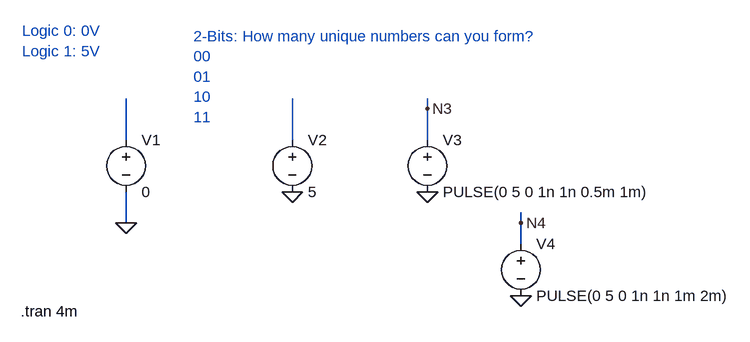
[diagram p0: schematic Sources.asc]
Sources.asc, the LTspice schematic file:
Version 4.1.1
SHEET 1 1336 680
WIRE 576 -32 576 -48
WIRE 112 16 112 -48
WIRE 368 16 368 -48
WIRE 576 16 576 -32
WIRE 112 144 112 96
WIRE 720 144 720 128
WIRE 720 176 720 144
FLAG 112 144 0
FLAG 368 96 0
FLAG 576 96 0
FLAG 720 256 0
FLAG 576 -32 N3
FLAG 720 144 N4
SYMBOL voltage 112 0 R0
WINDOW 123 0 0 Left 0
WINDOW 39 0 0 Left 0
SYMATTR InstName V1
SYMATTR Value 0
SYMBOL voltage 368 0 R0
WINDOW 123 0 0 Left 0
WINDOW 39 0 0 Left 0
SYMATTR InstName V2
SYMATTR Value 5
SYMBOL voltage 576 0 R0
WINDOW 123 0 0 Left 0
WINDOW 39 0 0 Left 0
SYMATTR InstName V3
SYMATTR Value PULSE(0 5 0 1n 1n 0.5m 1m)
SYMBOL voltage 720 160 R0
WINDOW 123 0 0 Left 0
WINDOW 39 0 0 Left 0
SYMATTR InstName V4
SYMATTR Value PULSE(0 5 0 1n 1n 1m 2m)
TEXT -48 -152 Left 2 ;Logic 0: 0V\nLogic 1: 5V
TEXT 216 -144 Left 2 ;2-Bits: How many unique numbers can you form?\n00\n01\n10\n11
TEXT -50 280 Left 2 !.tran 4m

The netlist it stands for:
* Sources.asc
V1 N001 0 0
V2 N002 0 5
V3 N3 0 PULSE(0 5 0 1n 1n 0.5m 1m)
V4 N4 0 PULSE(0 5 0 1n 1n 1m 2m)
* Logic 0: 0V
* Logic 1: 5V
* 2-Bits: How many unique numbers can you form?
* 00
* 01
* 10
* 11
.tran 4m
.backanno
.end